# Altium schematic sheet Master MicroController Port D.SchDoc: Master Micro Controller Port D Pin Out
size A4; DocumentNumber: 19; SheetNumber: 19; SheetTotal: 54
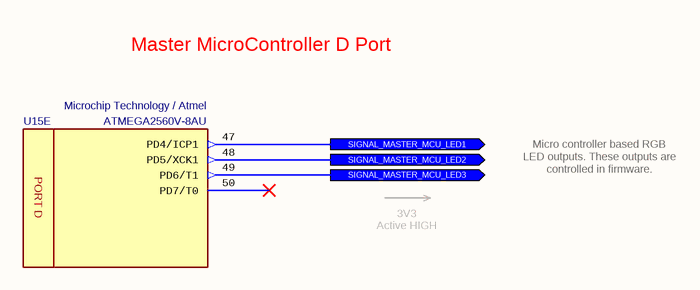
[diagram p0: Master MicroController Port D.SchDoc]

## Parts
U15  Manufacturer_Part_Number: ATMEGA2560V-8AU  Manufacturer_Name: Microchip Technology / Atmel  [TQFP100]  (hidden comment: 8-bit MicroController)  (part E of 15)

## Ports
SIGNAL_MASTER_MCU_LED1 (out), SIGNAL_MASTER_MCU_LED2 (out), SIGNAL_MASTER_MCU_LED3 (out)

## Nets
SIGNAL_MASTER_MCU_LED1: U15.47(PD4/ICP1) ; port SIGNAL_MASTER_MCU_LED1
SIGNAL_MASTER_MCU_LED2: U15.48(PD5/XCK1) ; port SIGNAL_MASTER_MCU_LED2
SIGNAL_MASTER_MCU_LED3: U15.49(PD6/T1) ; port SIGNAL_MASTER_MCU_LED3

Not connected (* = marked no-connect by the designer): U15 50(PD7/T0)*

## Notes on the sheet
- Master MicroController D Port
- 3V3
  Active HIGH
- Micro controller based RGB LED outputs. These outputs are controlled in firmware.
- Engineer
- All Rights are reserved to Customer and Engineer. [2021]
- Size:
- Date:
- A4
- Project :
- Time:
- Sheet
- of
- Customer
- Product ID
- Module ID
- Version
- File:
- Revision
- (in symbol IC - ATMEGA2560V-8AU, part E) PORT D

## Library data of the parts
U15 = IC - ATMEGA2560V-8AU: 8-bit Microcontrollers - MCU 256kB Flash 4kB EEPROM 86 I/O Pins; Supply Voltage - Min: 2V7; Supply Voltage - Max: 5.5V; Height: 1mm; Mouser_Part_Number: 556-ATMEGA2560V8AU; ComponentLink1Description: DataSheet; ComponentLink1URL: https://eu.mouser.com/datasheet/2/268/Atmel-2549-8-bit-AVR-Microcontroller-ATmega640-128-1315286.pdf; ROHS: Yes; Minimum Operating Temperature: -40; Maximum Operating Temperature: +85; ComponentLink2Description: Mouser; ComponentLink2URL: https://eu.mouser.com/ProductDetail/Microchip-Technology-Atmel/ATMEGA2560V-8AU?qs=sGAEpiMZZMutXGli8Ay4kKlCYcvZUWqJYdtgGFyqFT8%3D; Supplier 1: Mouser; Supplier 2: Arrow; Supplier 3: Farnell; Supplier 4: Newark; Supplier 5: Digi-Key; Supplier Part Number 1: 556-ATMEGA2560V8AU; Supplier Part Number 2: ATMEGA2560V-8AU; Supplier Part Number 3: 1288331; Supplier Part Number 4: 68T2784; Supplier Part Number 5: ATMEGA2560V-8AU-ND; Case: TQFP-100